# EAGLE design 20190505 (EAGLE 9.4.0)
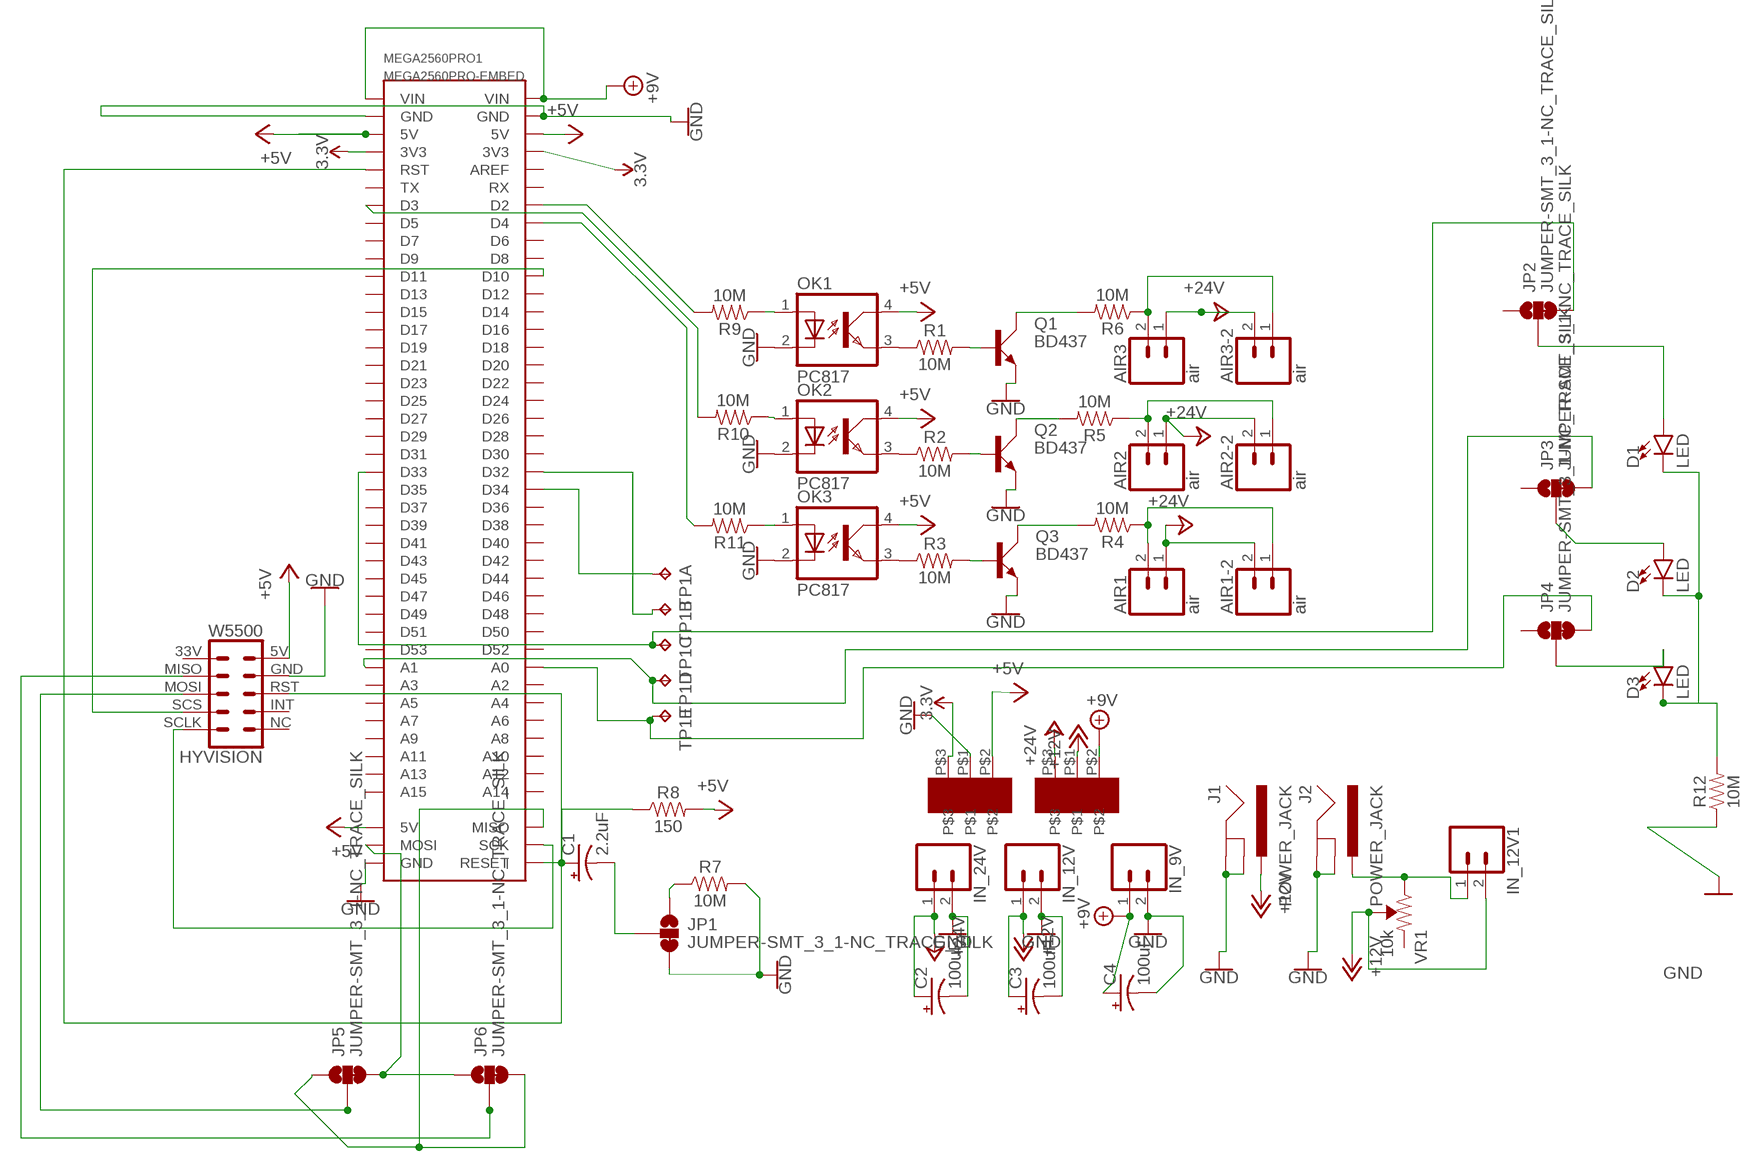
[diagram p0: schematic, sheet 1]

## Parts
AIR1  air  CONN_02POLAR_LOCK  [MOLEX-1X2_LOCK]
AIR1-2  air  CONN_02  [1X02]
AIR2  air  CONN_02POLAR_LOCK  [MOLEX-1X2_LOCK]
AIR2-2  air  CONN_02  [1X02]
AIR3  air  CONN_02POLAR_LOCK  [MOLEX-1X2_LOCK]
AIR3-2  air  CONN_02  [1X02]
C1  2.2uF  10UF-POLAR-RADIAL-2.5MM-KIT-25V-20%  [CPOL-RADIAL-2.5MM-5MM-KIT]
C2  100uF  100UF-POLAR-RADIAL-2.5MM-25V-20%  [CPOL-RADIAL-2.5MM-6.5MM]
C3  100uF  100UF-POLAR-RADIAL-2.5MM-25V-20%  [CPOL-RADIAL-2.5MM-6.5MM]
C4  100uF  100UF-POLAR-RADIAL-2.5MM-25V-20%  [CPOL-RADIAL-2.5MM-6.5MM]
D1  LED  LED5MM  [LED_5MM]
D2  LED  LED5MM  [LED_5MM]
D3  LED  LED5MM  [LED_5MM]
HYVISION  W5500  [W5500]
IN_9V  CONN_02POLAR_LOCK  [MOLEX-1X2_LOCK]
IN_12V  CONN_02POLAR_LOCK  [MOLEX-1X2_LOCK]
IN_12V1  CONN_02POLAR_LOCK  [MOLEX-1X2_LOCK]
IN_24V  CONN_02POLAR_LOCK  [MOLEX-1X2_LOCK]
J1  POWER_JACK  [POWER_JACK_PTH]
J2  POWER_JACK  [POWER_JACK_PTH]
JP1  JUMPER-SMT_3_1-NC_TRACE_SILK  [SMT-JUMPER_3_1-NC_TRACE_SILK]
JP2  JUMPER-SMT_3_1-NC_TRACE_SILK  [SMT-JUMPER_3_1-NC_TRACE_SILK]
JP3  JUMPER-SMT_3_1-NC_TRACE_SILK  [SMT-JUMPER_3_1-NC_TRACE_SILK]
JP4  JUMPER-SMT_3_1-NC_TRACE_SILK  [SMT-JUMPER_3_1-NC_TRACE_SILK]
JP5  JUMPER-SMT_3_1-NC_TRACE_SILK  [SMT-JUMPER_3_1-NC_TRACE_SILK]
JP6  JUMPER-SMT_3_1-NC_TRACE_SILK  [SMT-JUMPER_3_1-NC_TRACE_SILK]
MEGA2560PRO1  MEGA2560PRO-EMBED  [MEGA2560PRO-EMBED]
OK1  PC817  [DIL04]
OK2  PC817  [DIL04]
OK3  PC817  [DIL04]
Q1  BD437  [TO126AV]
Q2  BD437  [TO126AV]
Q3  BD437  [TO126AV]
R1  10M  10MOHM-HORIZ-1/4W-5%  [AXIAL-0.3]
R2  10M  10MOHM-HORIZ-1/4W-5%  [AXIAL-0.3]
R3  10M  10MOHM-HORIZ-1/4W-5%  [AXIAL-0.3]
R4  10M  10MOHM-HORIZ-1/4W-5%  [AXIAL-0.3]
R5  10M  10MOHM-HORIZ-1/4W-5%  [AXIAL-0.3]
R6  10M  10MOHM-HORIZ-1/4W-5%  [AXIAL-0.3]
R7  10M  10MOHM-HORIZ-1/4W-5%  [AXIAL-0.3]
R8  150  10MOHM-HORIZ-1/4W-5%  [AXIAL-0.3]
R9  10M  10MOHM-HORIZ-1/4W-5%  [AXIAL-0.3]
R10  10M  10MOHM-HORIZ-1/4W-5%  [AXIAL-0.3]
R11  10M  10MOHM-HORIZ-1/4W-5%  [AXIAL-0.3]
R12  10M  10MOHM-HORIZ-1/4W-5%  [AXIAL-0.3]
TP1  TP5P5-25-13  [P5-25-13]
U$2  AC_3PINAC3PIN7MM  [AC3PIN7MM]
U$4  AC_3PINAC3PIN7MM  [AC3PIN7MM]
VR1  10k  TRIMPOT-PTH-10MM-KNOB-1/2W-10%  [TRIMPOT-PTH-3386U]

## Nets
3.3V: MEGA2560PRO1.3V3@1(3V3) MEGA2560PRO1.3V3@2(3V3) U$4.P$3
+5V: HYVISION.5V MEGA2560PRO1.5V@1(5V) MEGA2560PRO1.5V@2(5V) MEGA2560PRO1.5V@3(5V) OK1.4(COL) OK2.4(COL) OK3.4(COL) R8.P$2 U$4.P$2
+9V: C4.1(+) IN_9V.1 MEGA2560PRO1.VIN@1(VIN) MEGA2560PRO1.VIN@2(VIN) U$2.P$2
+12V: C3.1(+) IN_12V1.2 IN_12V.1 J1.PWR U$2.P$1 VR1.2(WIPER)
+24V: AIR1-2.2 AIR1.1 AIR2-2.2 AIR2.1 AIR3-2.2 AIR3.1 C2.1(+) IN_24V.1 U$2.P$3
GND: C2.2(-) C3.2(-) C4.2(-) HYVISION.GND IN_9V.2 IN_12V.2 IN_24V.2 J1.GND J1.GNDBREAK J2.GND J2.GNDBREAK JP1.3 MEGA2560PRO1.GND@1(GND) MEGA2560PRO1.GND@2(GND) MEGA2560PRO1.GND@3(GND) OK1.2(C) OK2.2(C) OK3.2(C) Q1.E Q2.E Q3.E R7.P$2 R12.P$1 U$4.P$1
N$1: Q1.C R6.P$2
N$2: Q2.C R5.P$2
N$3: Q3.C R4.P$2
N$4: AIR1-2.1 AIR1.2 R4.P$1
N$5: AIR2-2.1 AIR2.2 R5.P$1
N$6: AIR3-2.1 AIR3.2 R6.P$1
N$7: OK1.3(EMIT) R1.P$1
N$8: OK2.3(EMIT) R2.P$1
N$9: OK3.3(EMIT) R3.P$1
N$10: Q3.B R3.P$2
N$11: Q2.B R2.P$2
N$12: Q1.B R1.P$2
N$13: C1.1(+) HYVISION.RST MEGA2560PRO1.RESET MEGA2560PRO1.RST R8.P$1
N$14: C1.2(-) JP1.2
N$15: OK1.1(A) R9.P$1
N$16: MEGA2560PRO1.D3 R10.P$2
N$17: OK2.1(A) R10.P$1
N$18: IN_12V1.1 J2.PWR VR1.3(CW)
N$19: MEGA2560PRO1.D34 TP1.TP-1
N$20: MEGA2560PRO1.D32 TP1.TP-2
N$21: JP1.1 R7.P$1
N$22: JP4.3 MEGA2560PRO1.A0 TP1.TP-5
N$23: JP3.3 MEGA2560PRO1.A1 TP1.TP-4
N$24: JP2.3 MEGA2560PRO1.D33 TP1.TP-3
N$25: D1.K(C) D2.K(C) D3.K(C) R12.P$2
N$26: D3.A JP4.2
N$27: OK3.1(A) R11.P$1
N$28: MEGA2560PRO1.D2 R9.P$2
N$29: MEGA2560PRO1.D4 R11.P$2
N$30: JP5.1 JP6.3 MEGA2560PRO1.MISO
N$31: HYVISION.SCLK MEGA2560PRO1.SCK
N$33: HYVISION.SCS MEGA2560PRO1.D10
N$34: D2.A JP3.2
N$35: D1.A JP2.2
N$36: JP5.3 JP6.1 MEGA2560PRO1.MOSI
N$37: HYVISION.MISO JP6.2
N$38: HYVISION.MOSI JP5.2
Unconnected: HYVISION.33V(3V3) HYVISION.INT HYVISION.NC JP2.1 JP3.1 JP4.1 MEGA2560PRO1.A2 MEGA2560PRO1.A3 MEGA2560PRO1.A4 MEGA2560PRO1.A5 MEGA2560PRO1.A6 MEGA2560PRO1.A7 MEGA2560PRO1.A8 MEGA2560PRO1.A9 MEGA2560PRO1.A10 MEGA2560PRO1.A11 MEGA2560PRO1.A12 MEGA2560PRO1.A13 MEGA2560PRO1.A14 MEGA2560PRO1.A15 MEGA2560PRO1.AREF MEGA2560PRO1.D5 MEGA2560PRO1.D6 MEGA2560PRO1.D7 MEGA2560PRO1.D8 MEGA2560PRO1.D9 MEGA2560PRO1.D11 MEGA2560PRO1.D12 MEGA2560PRO1.D13 MEGA2560PRO1.D14 MEGA2560PRO1.D15 MEGA2560PRO1.D16 MEGA2560PRO1.D17 MEGA2560PRO1.D18 MEGA2560PRO1.D19 MEGA2560PRO1.D20 MEGA2560PRO1.D21 MEGA2560PRO1.D22 MEGA2560PRO1.D23 MEGA2560PRO1.D24 MEGA2560PRO1.D25 MEGA2560PRO1.D26 MEGA2560PRO1.D27 MEGA2560PRO1.D28 MEGA2560PRO1.D29 MEGA2560PRO1.D30 MEGA2560PRO1.D31 MEGA2560PRO1.D35 MEGA2560PRO1.D36 MEGA2560PRO1.D37 MEGA2560PRO1.D38 MEGA2560PRO1.D39 MEGA2560PRO1.D40 MEGA2560PRO1.D41 MEGA2560PRO1.D42 MEGA2560PRO1.D43 MEGA2560PRO1.D44 MEGA2560PRO1.D45 MEGA2560PRO1.D46 MEGA2560PRO1.D47 MEGA2560PRO1.D48 MEGA2560PRO1.D49 MEGA2560PRO1.D50 MEGA2560PRO1.D51 MEGA2560PRO1.D52 MEGA2560PRO1.D53 MEGA2560PRO1.RX MEGA2560PRO1.TX VR1.1(CCW)

## Library data of the parts
AIR1-AIR3 IN_9V IN_12V IN_12V1 IN_24V = SparkFun-Connectors:CONN_02: Multi connection point. Often used as Generic Header-pin footprint for 0.1 inch spaced/style header connections On any of the 0.1 inch spaced packages, you can populate with these: Break Away Headers - Straight <https://www.sparkfun.com/products/116> (PRT-00116) Break Away Male Headers - Right Angle <https://www.sparkfun.com/products/553> (PRT-00553) Female Headers <https://www.sparkfun.com/products/115> (PRT-00115) Break Away Headers - Machine Pin <https://www.sparkfun.com/products/117> (PRT-00117) Break Away Female Headers - Swiss Machine Pin <https://www.sparkfun.com/products/743> (PRT-00743) For SCREWTERMINALS and SPRING TERMINALS visit here: Screw Terimnals on SparkFun.com <https://www.sparkfun.com/search/results?term=Screw+Terminals> (5mm/3.5mm/2.54mm spacing) This device is also useful as a general connection point to wire up your design to another part of your project. Our various solder wires solder well into these plated through hole pads. Hook-Up Wire - Assortment (Stranded, 22 AWG) <https://www.sparkfun.com/products/11375> (PRT-11375) Hook-Up Wire - Assortment (Solid Core, 22 AWG) <https://www.sparkfun.com/products/11367> (PRT-11367) View the entire wire category on our website here <https://www.sparkfun.com/categories/141> Special notes: Molex polarized connector foot print use with: PRT-08233 with associated crimp pins and housings. 2.54_SCREWTERM for use with PRT-10571. 3.5mm Screw Terminal footprints for PRT-08084 5mm Screw Terminal footprints for use with PRT-08432; SF_ID: PRT-09918
AIR1-2 AIR2-2 AIR3-2 = SparkFun-Connectors:CONN_02: Multi connection point. Often used as Generic Header-pin footprint for 0.1 inch spaced/style header connections On any of the 0.1 inch spaced packages, you can populate with these: Break Away Headers - Straight <https://www.sparkfun.com/products/116> (PRT-00116) Break Away Male Headers - Right Angle <https://www.sparkfun.com/products/553> (PRT-00553) Female Headers <https://www.sparkfun.com/products/115> (PRT-00115) Break Away Headers - Machine Pin <https://www.sparkfun.com/products/117> (PRT-00117) Break Away Female Headers - Swiss Machine Pin <https://www.sparkfun.com/products/743> (PRT-00743) For SCREWTERMINALS and SPRING TERMINALS visit here: Screw Terimnals on SparkFun.com <https://www.sparkfun.com/search/results?term=Screw+Terminals> (5mm/3.5mm/2.54mm spacing) This device is also useful as a general connection point to wire up your design to another part of your project. Our various solder wires solder well into these plated through hole pads. Hook-Up Wire - Assortment (Stranded, 22 AWG) <https://www.sparkfun.com/products/11375> (PRT-11375) Hook-Up Wire - Assortment (Solid Core, 22 AWG) <https://www.sparkfun.com/products/11367> (PRT-11367) View the entire wire category on our website here <https://www.sparkfun.com/categories/141> Special notes: Molex polarized connector foot print use with: PRT-08233 with associated crimp pins and housings. 2.54_SCREWTERM for use with PRT-10571. 3.5mm Screw Terminal footprints for PRT-08084 5mm Screw Terminal footprints for use with PRT-08432
C1 = SparkFun-Capacitors:10UF-POLAR: 10.0µF polarized capacitors A capacitor is a passive two-terminal electrical component used to store electrical energy temporarily in an electric field.; PROD_ID: CAP-08440; VALUE: 10uF
C2-C4 = SparkFun-Capacitors:100UF-POLAR: 100µF polarized capacitors A capacitor is a passive two-terminal electrical component used to store electrical energy temporarily in an electric field.; PROD_ID: CAP-08439
D1-D3 = SparkFun-LED:LED: LED (Generic) Standard schematic elements and footprints for 5mm, 3mm, 1206, and 0603 sized LEDs. Generic LEDs with no color specified.
HYVISION = DECADE2019:W5500
J1 J2 = SparkFun-Connectors:POWER_JACK: Power Jack Connector This is the standard 5.5mm barrel jack for power. The PTH is the most common, proven, reliable, footprint. The Slot footprint only works if the mill layer is transmitted to the PCB fab house so be warned. Here are the connectors we sell at SparkFun: DC Barrel Power Jack/Connector <https://www.sparkfun.com/products/119> (PRT-00119) DC Barrel Power Jack/Connector (SMD) <https://www.sparkfun.com/products/12748> (PRT-12748) DC Barrel Jack Adapter - Breadboard Compatible <https://www.sparkfun.com/products/10811> (PRT-10811) It is used on this SparkFun product (and many, many others): SparkFun RedBoard - Programmed with Arduino <https://www.sparkfun.com/products/12757> (DEV-12757) Also, if you need a mating power supply or connector, please check these out: Wall Adapter Power Supply - 9VDC 650mA <https://www.sparkfun.com/products/298> (TOL-00298) DC Barrel Jack Adapter - Male <https://www.sparkfun.com/products/10287> (PRT-10287); PROD_ID: CONN-08197
JP1-JP6 = SparkFun-Jumpers:JUMPER-SMT_3_1-NC_TRACE: Normally closed trace jumper (1 of 2 connections) This jumper has a trace between two pads so it's normally closed (NC). The other connection is normally open (NO). Use a razor knife to open the connection. For best results follow the IPC guidelines for cutting traces: Cutout at least 0.063 mm (0.005 in). Remove all loose material to clean up the cut area. Seal the cut with an approved epoxy. Reapply solder to reclose the connection, or to close the NO connection.
MEGA2560PRO1 = robotdyn:MEGA2560PRO-EMBED: Robotdyn Robotdyn Mega 2560 PRO (Embed) https://robotdyn.com/mega-2560-pro-embed-ch340g-atmega2560-16au.html
OK1-OK3 = optocoupler:PC817: SHARP OPTO COUPLER; MPN: PC817X4J000F; OC_FARNELL: 9707727; OC_NEWARK: 97K7059
Q1-Q3 = transistor-power:BD437: NPN TRANSISTOR
R1-R7 R9-R12 = SparkFun-Resistors:10MOHM: RES-09327; PROD_ID: RES-09327
R8 = SparkFun-Resistors:10MOHM: RES-09327; PROD_ID: RES-09327; VALUE: 10M
TP1 = testpad:TP5: Test pad
U$2 U$4 = DECADE2019:AC_3PIN
VR1 = SparkFun-Resistors:TRIMPOT: Trimming Potentiometer (Trimpot) Three-terminal potentiometers, with an adjustable wiper and two adjustable resistors. A pot can be used to create a configurable voltage divider, or as a variable resistor. "Trimpots" are a subset of potentiometers, usually intended for "set-and-forget" applications. They're often more delicate than standard potentiometers - rated for fewer turns. Variants PTH-KNOB - PTH Trimpot w/ finger-adjustable knob Trimpot 10K with Knob <https://www.sparkfun.com/products/9806> (COM-09806) Datasheet <http://www.sparkfun.com/datasheets/Components/General/TSR-3386.pdf> SMD-3MM-CLOSED-FRAME - SMD 3mm Square Closed-Frame Trimpot Used on e.g. EasyDriver - Stepper Motor Driver <https://www.sparkfun.com/products/12779> Datasheet <http://www.bitechnologies.com/pdfs/22.pdf> (22AR10KTR) SMD-5MM - SMD 5mm Square Closed-Frame Trimpot Used on e.g. IOIO-OTG - V2.2 <https://www.sparkfun.com/products/13613> Datasheet <http://www.vishay.com/docs/51008/ts53.pdf> (TS53YL502MR10) SMD-3MM-1/10W-25% - 3mm Square Open-Frame Trimpot Used on e.g. SparkFun Shapeoko <https://www.sparkfun.com/products/13899> Datasheet <http://www.bourns.com/docs/Product-Datasheets/TC33.pdf> (TC33X-2-103E); PROD_ID: RES-09730; SF_SKU: COM-09806

## Board
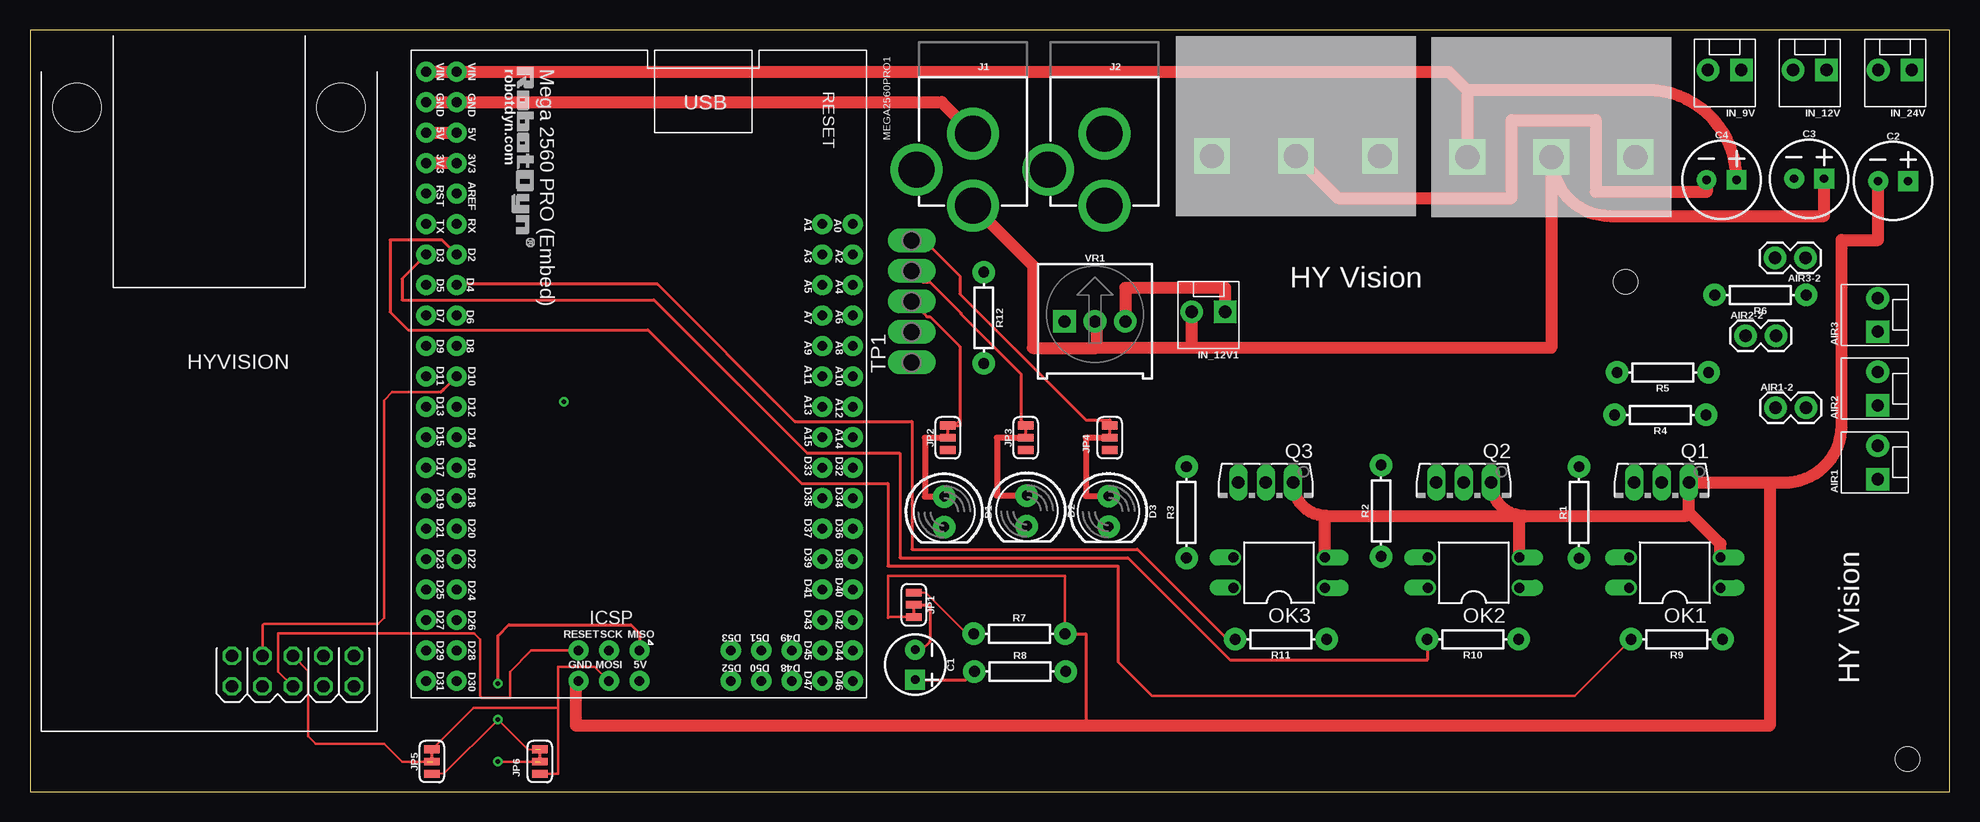
[diagram p1: board, top side]
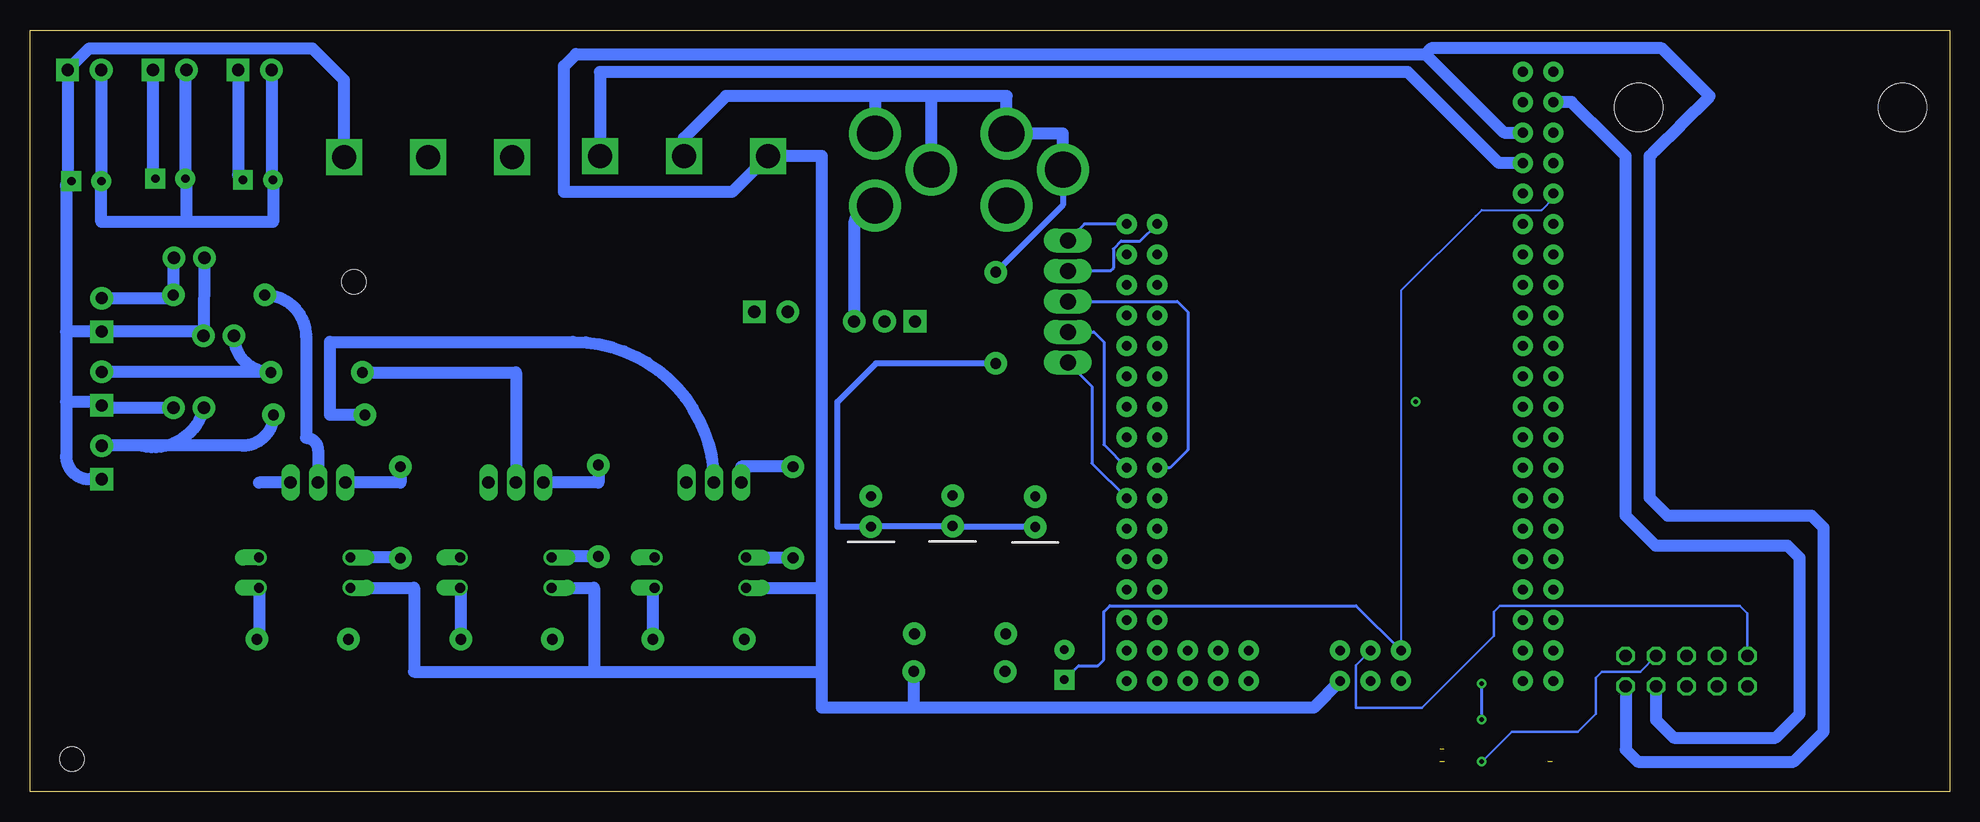
[diagram p2: board, bottom side, seen from below]

Size 160 x 63.5 mm. Coordinates in mm from the lower left corner, seen from the top.
Outline: 0,0 160,0 160,63.5 0,63.5 0,0
Copper layers (1*16): Top 0.035mm / dielectric 1.5mm / Bottom 0.035mm
Design rules "default": minimum track width 6mil, minimum drill 0.35mm, track to track 6mil, track to pad 6mil, pad to pad 6mil, via to via 6mil, smd to smd 6mil, copper to edge 40mil, drill to drill 6mil, minimum pad ring 10mil, minimum via ring 8mil, stop-mask expansion 4mil, vias tented up to drill 0mil, thermal gap 10mil
Holes 2 mm at 133,42.5 156.5,2.7

### Footprints (pad centres in the part's own frame; a part is rotated, then mirrored left to right if it is on the bottom)
MOLEX-1X2_LOCK = drill 1.016 pad 1.88 square: 1 -0.127,0 | drill 1.016 pad 1.88: 2 2.667,0
1X02 = drill 1.016 pad 1.88: 1 0,0; 2 2.54,0
CPOL-RADIAL-2.5MM-5MM-KIT = drill 0.7 pad 1.651 square: 1 1.25,0 | drill 0.7 pad 1.651: 2 -1.25,0
CPOL-RADIAL-2.5MM-6.5MM = drill 0.7 pad 1.651 square: 1 1.25,0 | drill 0.7 pad 1.651: 2 -1.25,0
LED_5MM = drill 0.813 pad 1.88: A -1.27,0; K 1.27,0
W5500 = drill 1.016 octagon: 5V 6.08,-1.27; 33V 6.08,1.27; GND 3.54,-1.27; INT -1.54,-1.27; MISO 3.54,1.27; MOSI 1,1.27; NC -4.08,-1.27; RST 1,-1.27; SCLK -4.08,1.27; SCS -1.54,1.27 | hole 4: -17,47; 5,47
POWER_JACK_PTH = drill 2.997 pad 4.318: GND 0,7.7; GNDBREAK 4.7,10.7; PWR 0,13.7
SMT-JUMPER_3_1-NC_TRACE_SILK = smd 0.635 x 1.27: 1 -1.016,0; 2 0,0; 3 1.016,0
MEGA2560PRO-EMBED = drill 0.8 pad 1.676: 3V3@1 -25.4,-19.05; 3V3@2 -25.4,-16.51; 5V@1 -27.94,-19.05; 5V@2 -27.94,-16.51; 5V@3 17.78,-1.27; A0 -20.32,16.51; A1 -20.32,13.97; A2 -17.78,16.51; A3 -17.78,13.97; A4 -15.24,16.51; A5 -15.24,13.97; A6 -12.7,16.51; A7 -12.7,13.97; A8 -10.16,16.51; A9 -10.16,13.97; A10 -7.62,16.51; A11 -7.62,13.97; A12 -5.08,16.51; A13 -5.08,13.97; A14 -2.54,16.51; A15 -2.54,13.97; AREF -22.86,-16.51; D2 -17.78,-16.51; D3 -17.78,-19.05; D4 -15.24,-16.51; D5 -15.24,-19.05; D6 -12.7,-16.51; D7 -12.7,-19.05; D8 -10.16,-16.51; D9 -10.16,-19.05; D10 -7.62,-16.51; D11 -7.62,-19.05; D12 -5.08,-16.51; D13 -5.08,-19.05; D14 -2.54,-16.51; D15 -2.54,-19.05; D16 0,-16.51; D17 0,-19.05; D18 2.54,-16.51; D19 2.54,-19.05; D20 5.08,-16.51; D21 5.08,-19.05; D22 7.62,-16.51; D23 7.62,-19.05; D24 10.16,-16.51; D25 10.16,-19.05; D26 12.7,-16.51; D27 12.7,-19.05; D28 15.24,-16.51; D29 15.24,-19.05; D30 17.78,-16.51; D31 17.78,-19.05; D32 0,16.51; D33 0,13.97; D34 2.54,16.51; D35 2.54,13.97; D36 5.08,16.51; D37 5.08,13.97; D38 7.62,16.51; D39 7.62,13.97; D40 10.16,16.51; D41 10.16,13.97; D42 12.7,16.51; D43 12.7,13.97; D44 15.24,16.51; D45 15.24,13.97; D46 17.78,16.51; D47 17.78,13.97; D48 17.78,11.43; D49 15.24,11.43; D50 17.78,8.89; D51 15.24,8.89; D52 17.78,6.35; D53 15.24,6.35; GND@1 -30.48,-19.05; GND@2 -30.48,-16.51; GND@3 17.78,-6.35; MISO 15.24,-1.27; MOSI 17.78,-3.81; RESET 15.24,-6.35; RST -22.86,-19.05; RX -20.32,-16.51; SCK 15.24,-3.81; TX -20.32,-19.05; VIN@1 -33.02,-19.05; VIN@2 -33.02,-16.51
DIL04 = drill 0.813 offset: 1 -1.27,-3.81; 2 1.27,-3.81; 3 1.27,3.81; 4 -1.27,3.81
TO126AV = drill 1.016 long: B 2.286,-1.27; C 0,-1.27; E -2.286,-1.27
AXIAL-0.3 = drill 0.9 pad 1.88: P$1 -3.81,0; P$2 3.81,0
P5-25-13 = drill 1.321 pad 1.905 long: TP-1 -5.08,0; TP-2 -2.54,0; TP-3 0,0; TP-4 2.54,0; TP-5 5.08,0
AC3PIN7MM = drill 2 square: P$1 0,0; P$2 7,0; P$3 -7,0
TRIMPOT-PTH-3386U = drill 1.016 pad 1.88 square: 1 -2.54,-0.015 | drill 1.016 pad 1.88: 2 0,-0.015; 3 2.54,-0.015

### Placement (x,y rotation side)
AIR1  154.02,26.17 90 top
AIR1-2  145.5,32 0 top
AIR2  154.02,32.32 90 top
AIR2-2  143,38 0 top
AIR3  154.02,38.47 90 top
AIR3-2  148,44.5 180 top
C1  73.78,10.57 270 top
C2  155.3,50.9 0 top
C3  148.3,51.1 0 top
C4  141,51 0 top
D1  76.2,23.33 270 top
D2  83.1,23.41 270 top
D3  89.9,23.36 270 top
HYVISION  20.92,10.04 0 top
IN_9V  142.53,60.17 180 top
IN_12V  149.63,60.17 180 top
IN_12V1  99.5,40 180 top
IN_24V  156.73,60.17 180 top
J1  78.6,62.56 180 top
J2  89.57,62.56 180 top
JP1  73.66,15.57 270 top
JP2  76.5,29.5 90 top
JP3  83,29.5 90 top
JP4  90,29.5 90 top
JP5  33.5,2.5 90 top
JP6  42.5,2.5 90 top
MEGA2560PRO1  52.07,27 270 top
OK1  137.1,18.25 90 top
OK2  120.34,18.25 90 top
OK3  104.12,18.25 90 top
Q1  136,24.5 180 top
Q2  119.5,24.5 180 top
Q3  103,24.5 180 top
R1  129.12,23.27 90 top
R2  112.62,23.41 90 top
R3  96.4,23.28 90 top
R4  135.9,31.4 180 top
R5  136.1,34.95 180 top
R6  144.24,41.4 180 top
R7  82.47,13.15 0 top
R8  82.53,10.01 0 top
R9  137.27,12.7 180 top
R10  120.27,12.7 180 top
R11  104.27,12.7 180 top
R12  79.5,39.5 270 top
TP1  73.49,40.86 90 top
U$2  126.82,52.9 180 top
U$4  105.5,53 180 top
VR1  88.77,39.21 0 top

### Tracks (layer width: path | path; a pad name or v marks a point on that pad's centre or on a via)
3.3V
  Top 0.152: 35.66,52.5 35.58,52.42 MEGA2560PRO1.3V3@2
  Top 1.016: MEGA2560PRO1.3V3@1 33.02,52.42 35.58,52.42
  Bottom 1.016: MEGA2560PRO1.3V3@2 37.56,52.4 45.16,60 112.5,60 U$4.P$3
+5V
  Top 1.016: MEGA2560PRO1.5V@1 MEGA2560PRO1.5V@2
  Bottom 1.016: OK3.4 94,16.98 | 94,16.98 94,53 U$4.P$2 101.5,50 115.5,50 115.5,60.5 114.5,61.5 43.7,61.5 | OK2.4 113,16.98 113,10 | 113,10 94,10 | 94,10 94,16.98 | OK1.4 128,16.98 128,10 113,10 | 94,10 94,7 86.5,7 | R8.P$2 86.34,7.16 86.5,7 | MEGA2560PRO1.5V@3 53.02,7 86.5,7 | MEGA2560PRO1.5V@2 37.14,54.94 43.7,61.5 | HYVISION.5V 27,3.5 26,2.5 13,2.5 10.5,5 10.5,22 11.5,23 23.5,23 25,24.5 25,53 24.48,53.52 24.46,53.52 22.4,55.58 22.4,55.6 20,58 23.98,61.98 43.22,61.98 43.7,61.5
+9V
  Top 1.016: C4.1 arc90 134.75,58.5 119.8,58.5 | 119.8,58.5 arc-90 119.82,58.48 U$2.P$2 | 119.8,58.5 118.28,60.02 MEGA2560PRO1.VIN@2 MEGA2560PRO1.VIN@1
  Bottom 1.016: IN_9V.1 142.66,51.41 C4.1
+12V
  Top 1.016: 96.83,37 88.9,37 | IN_12V1.2 96.83,37 | J1.PWR 83.6,43.86 83.6,37 88.9,37 | VR1.2 88.9,39.06 88.9,37 | 96.83,37 126.8,37 126.8,52.9 U$2.P$1 arc90 131.72,48 149.55,48 C3.1
  Bottom 1.016: IN_12V.1 149.76,51.31 C3.1
+24V
  Top 0.152: 156.51,50.98 C2.1
  Bottom 1.016: AIR1.1 155.04,26.04 arc90 157,28 157,32.5 | 157,38.34 AIR3.1 145.88,38.34 arc90 AIR2-2.2 AIR3-2.2 | 157,38.34 157,32.5 | 157,32.5 154.02,32.5 AIR2.1 154.02,32 AIR1-2.2 | 157,38.34 157,50.45 arc90 C2.1 156.86,51.21 IN_24V.1 155.05,61.98 136.48,61.98 133.82,59.32 U$2.P$3
GND
  Top 0.152: 33.07,57.38 MEGA2560PRO1.GND@1
  Top 0.203: JP1.3 71.55,14.55 71.5,14.5 71.5,18 86.28,18 R7.P$2 | MEGA2560PRO1.GND@3 45.5,9.22 45.22,9.22
  Top 0.254: R7.P$2 88,13.15 88,5.5
  Top 1.016: 145,25.77 Q1.E 138.29,23.29 | 145,25.77 146.27,25.77 arc90 151,30.5 151,46 154.05,46 C2.2 | Q2.E arc90 124.56,23 | 124.56,23 138,23 arc90 138.29,23.29 | Q3.E arc90 108.06,23 | 108.06,23 124.56,23 | J1.GND 75.98,57.48 MEGA2560PRO1.GND@2 MEGA2560PRO1.GND@1 | 145,25.77 145,5.5 88,5.5 45.5,5.5 45.5,9.22 | U$4.P$1 109,49.5 123.5,49.5 123.5,56 130.5,56 130.5,50 139.75,50 C4.2 | OK3.2 107.93,22.87 108.06,23 | OK2.2 124.15,22.59 124.56,23 | OK1.2 140.91,20.66 138.29,23.29
  Bottom 0.152: 121.46,25.53 Q2.E | 137.92,25.53 Q1.E 138.53,26.14 | 86.23,13.15 R7.P$2 | 74.07,51.44 J1.GNDBREAK
  Bottom 0.254: IN_12V.2 147.05,60.08
  Bottom 0.508: J1.GNDBREAK 73.9,48.91 R12.P$1
  Bottom 1.016: 89.57,58 102,58 105.5,54.5 U$4.P$1 | 89.57,58 J2.GND | 84.87,58 78.6,58 J1.GND 73.9,54.86 J1.GNDBREAK | 84.87,58 89.57,58 | J2.GNDBREAK 84.87,58 | 147.05,60.08 C3.2 147,51.1 147,47.5 | IN_24V.2 arc90 154.05,60.16 C2.2 154.05,47.5 147,47.5 | Q1.E 140.91,25.77 | MEGA2560PRO1.GND@1 31.52,57.48 29.78,55.74 29.74,55.74 27,53 27,23 24.5,20.5 13.5,20.5 12.5,19.5 12.5,6.5 14.5,4.5 23,4.5 24.46,5.96 HYVISION.GND | IN_9V.2 139.86,51 C4.2 139.75,47.5 147,47.5
N$1
  Bottom 1.016: R6.P$2 arc90 137,37.97 137,29.5 arc90 136,28.5 Q1.C
N$2
  Bottom 1.016: R5.P$2 119.5,34.95 Q2.C
N$3
  Bottom 1.016: R4.P$2 135,31.4 135,37.5 114.73,37.5 arc90 Q3.C
N$4
  Bottom 1.016: AIR1.2 153.95,28.84 | R4.P$1 arc90 142.27,28.84 AIR1.2 | AIR1-2.1 arc90 150.66,28.84 AIR1.2
N$5
  Bottom 1.016: R5.P$1 arc-90 139.95,34.99 139.99,34.99 | 139.99,34.99 AIR2.2 | AIR2-2.1 arc-90 139.99,34.99
N$6
  Bottom 1.016: AIR3.2 148.05,41.14 R6.P$1 148.05,44.5 AIR3-2.1
N$7
  Bottom 1.016: R1.P$1 129.12,19.52 OK1.3
N$8
  Bottom 1.016: R2.P$1 116.53,19.6 OK2.3
N$9
  Bottom 1.016: R3.P$1 100.31,19.47 OK3.3
N$10
  Bottom 1.016: R3.P$2 100.71,27.09 Q3.B
N$11
  Bottom 1.016: R2.P$2 112.62,25.77 Q2.B
N$12
  Bottom 1.016: R1.P$2 129.12,25.77 Q1.B
N$13
  Top 0.2: HYVISION.RST 20.7,9.99 20.7,13.2 37,13.2 37.5,12.7 37.5,8 37.7,7.8 40,7.8 40,10 41.76,11.76 MEGA2560PRO1.RESET
  Top 0.254: C1.1 78.03,9.32 R8.P$1
  Bottom 0.152: 39.49,47.99 39.5,48 | 39.49,47.99 38.98,48.5 34,48.5 33.02,49.48 MEGA2560PRO1.RST | 39.49,47.99 45.72,41.76 MEGA2560PRO1.RESET
  Bottom 0.254: C1.1 72.6,10.5 71,10.5 70.5,11 70.5,15 70,15.5 49.46,15.5 MEGA2560PRO1.RESET 45.68,11.8
N$14
  Top 0.254: 73.25,15.57 JP1.2 74.93,15.57 75,15.5 75,12.5 74.32,11.82 C1.2
N$15
  Bottom 1.016: OK1.1 140.91,12.7 R9.P$1
N$16
  Top 0.152: 116.43,12.72 R10.P$2
  Top 0.254: MEGA2560PRO1.D3 31,42.76 31,41 52,41 64.78,28.22 72.5,28.22 72.5,19.5 91.5,19.5 100,11 116.5,11 116.5,12.65 R10.P$2
N$17
  Bottom 1.016: R10.P$1 124.08,16.98 OK2.1
N$18
  Top 1.016: IN_12V1.1 99.63,42 91.31,42 VR1.3
  Bottom 1.016: J2.PWR arc-90 91.31,47.12 VR1.3
N$19
  Bottom 0.254: TP1.TP-1 71.49,33.78 71.49,27.37 MEGA2560PRO1.D34
N$20
  Bottom 0.254: TP1.TP-2 71.32,38.32 70.5,37.5 70.5,28.92 MEGA2560PRO1.D32
N$21
  Top 0.152: R7.P$1 78.1,13.15 74.66,16.59 JP1.1
N$22
  Top 0.254: TP1.TP-5 74.56,45.94 77.5,43 77.5,41.5 88,31 90,31 90,30.92 JP4.3
  Bottom 0.254: MEGA2560PRO1.A0 72.11,47.32 TP1.TP-5
N$23
  Top 0.254: TP1.TP-4 74.39,42.5 75,42.5 77.59,39.91 77.59,39.83 82.59,34.83 82.59,31 | 82.59,31 82.59,30.52 | JP3.3 83,30.59 82.59,31
  Bottom 0.254: TP1.TP-4 69.96,43.4 69.7,43.66 69.7,45.24 69.04,45.9 67.46,45.9 MEGA2560PRO1.A1
N$24
  Top 0.254: TP1.TP-3 74.76,39.59 75.01,39.59 77.5,37.1 77.5,31 | 77.5,31 77.5,30.5 77.09,30.5 77.08,30.52 76.09,30.52 | JP2.3 77.02,30.52 77.5,31
  Bottom 0.254: TP1.TP-3 64.36,40.86 63.5,40 63.5,28.5 65,27 MEGA2560PRO1.D33
N$25
  Bottom 0.508: R12.P$2 89.5,35.69 92.69,32.5 92.69,22.09 D3.K 83.1,22.09 D2.K | D2.K 83.05,22.09 | D1.K 83.1,22.06 D2.K
N$26
  Top 0.508: JP4.2 88,29.5 88,24.63 D3.A
N$27
  Bottom 1.016: OK3.1 108.08,16.98 R11.P$1
N$28
  Top 0.152: 133.35,12.72 R9.P$2
  Top 0.203: R9.P$2 128.76,8 93.5,8
  Top 0.254: MEGA2560PRO1.D2 34.34,46 30,46 30,40 31.5,38.5 51.5,38.5 64.3,25.7 71.5,25.7 71.5,18.8 90.7,18.8 90.7,10.8 93.5,8
N$29
  Top 0.152: 100.43,12.72 R11.P$2
  Top 0.254: R11.P$2 99.81,12.7 92.3,20.2 73.5,20.2 73.5,30.86 63.74,30.86 52.3,42.3 35.62,42.3 MEGA2560PRO1.D4
N$30  (via drill 0.35)  (1 unrouted)
  Top 0.152: 42.14,3.52 41.48,3.52 v39,6 34.48,1.48 JP5.1
  Top 0.254: v39,9 39,13 39.9,13.9 50.1,13.9 50.8,13.2 MEGA2560PRO1.MISO
  Bottom 0.254: v39,6 v39,9
N$31
  Bottom 0.2: MEGA2560PRO1.SCK 49.5,10.52 49.5,7 44,7 38,13 38,15 37.5,15.5 17.5,15.5 16.84,14.84 HYVISION.SCLK
N$32  (via drill 0.35)
  other vias: 44.5,32.5
N$33
  Top 0.2: 34.24,33.3 30.2,33.3 29.5,32.6 29.5,14.5 29,14 19.5,14 19.38,13.88 HYVISION.SCS
  Top 0.254: MEGA2560PRO1.D10 34.47,33.53 34.24,33.3
N$34
  Top 0.508: JP3.2 80.6,29.5 80.6,24.68 D2.A
N$35
  Top 0.508: JP2.2 74.6,29.5 74.6,24.6 D1.A
N$36
  Top 0.2: MEGA2560PRO1.MOSI 47.08,10.4 44,10.4 44,7 | 44,7 44,1.5 43.98,1.48 JP6.1 | JP5.3 36.98,7 44,7
N$37  (via drill 0.35)  (1 unrouted)
  Top 0.2: v39,2.5 42.12,2.5
  Bottom 0.2: HYVISION.MISO 25.77,10 29,10 29.5,9.5 29.5,6.5 31,5 36.5,5 v39,2.5
N$38  (1 unrouted)
  Top 0.2: HYVISION.MOSI 23.2,10.03 23.2,4.6 23.8,4 29.5,4 31,2.5 33.12,2.5

### Text on the board
tPlace: HY Vision | HY Vision